# Altium schematic sheet VoltageSense.SchDoc
size A; SheetNumber: 5; SheetTotal: 5
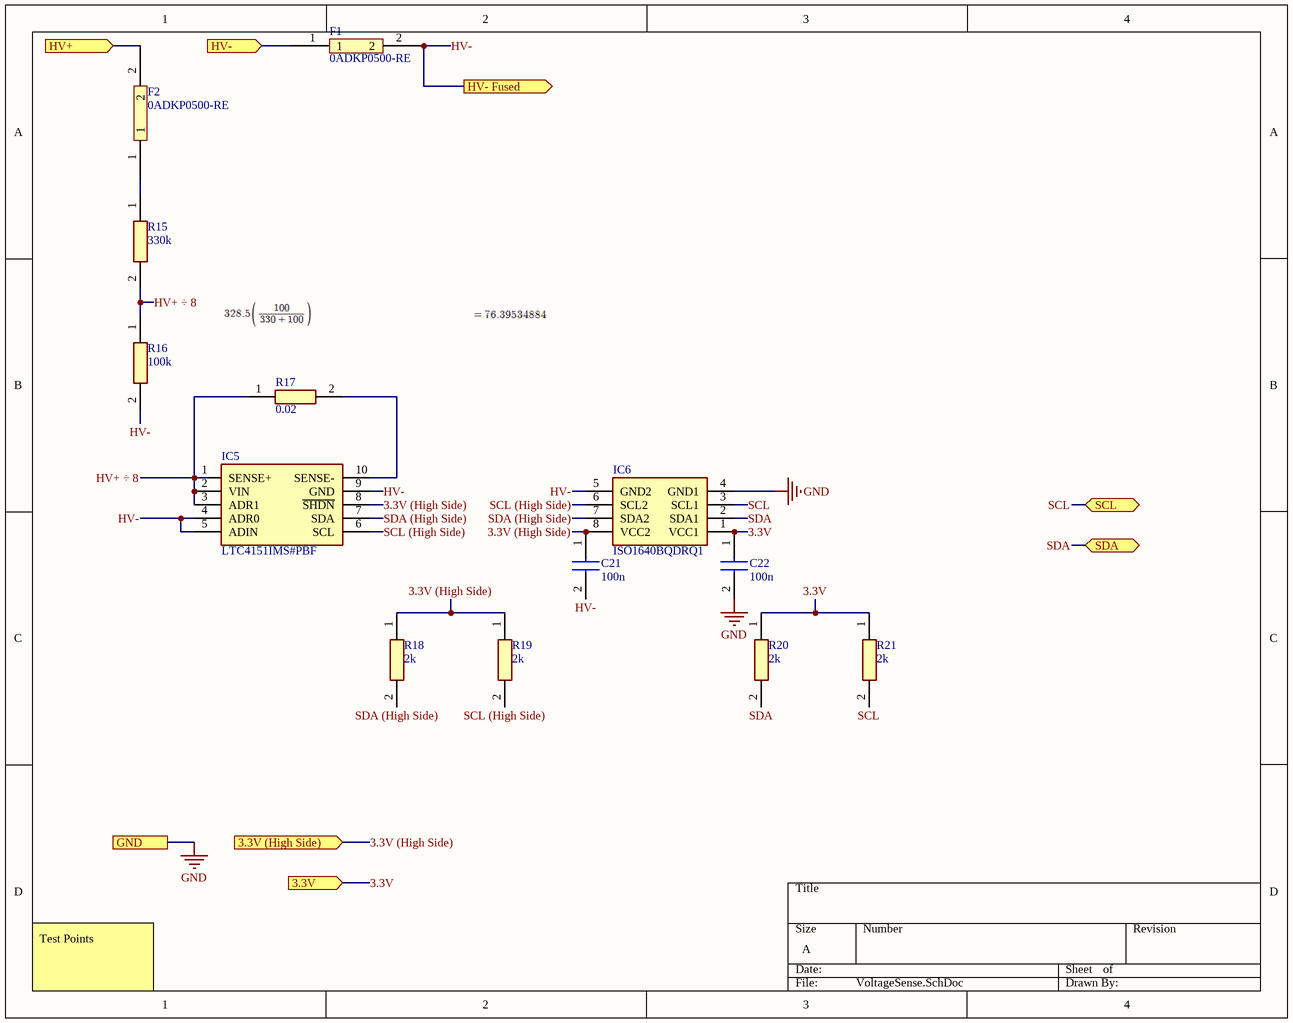
[diagram p0: VoltageSense.SchDoc]

## Parts
C21  100n  [CAPC3216X94N]
C22  100n  [CAPC3216X94N]
F1  0ADKP0500-RE  [0ADKP0500-RE]
F2  0ADKP0500-RE  [0ADKP0500-RE]
IC5  LTC4151IMS#PBF  [SOP50P490X110-10N]
IC6  ISO1640BQDRQ1  [SOIC127P600X175-8N]
R15  330k  [ERJP08_(1206)]
R16  100k  [RESC3216X65N]
R17  0.02  [RESC3216X68N]
R18  2k  [RESC3116X65N]
R19  2k  [RESC3116X65N]
R20  2k  [RESC3116X65N]
R21  2k  [RESC3116X65N]

## Ports
3.3V (High Side) (in), 3.3V (in), GND, HV+ (in), HV- (in), HV- Fused (out), SCL (bidir), SDA (bidir)

## Nets
GND: C22.2 IC6.4(GND1) ; port GND
3.3V: C22.1 IC6.1(VCC1) R20.1 R21.1 ; port 3.3V
3.3V (High Side): C21.1 IC5.8(~{SHDN}) IC6.8(VCC2) R18.1 R19.1 ; port 3.3V (High Side)
HV+: F2.2 ; port HV+
HV+ ÷ 8: IC5.1(SENSE+) IC5.2(VIN) IC5.3(ADR1) R15.2 R16.1 R17.1
HV-: C21.2 F1.2 IC5.4(ADR0) IC5.5(ADIN) IC5.9(GND) IC6.5(GND2) R16.2 ; port HV- Fused
HV-: F1.1 ; port HV-  [a separate net that carries the same name]
SCL: IC6.3(SCL1) R21.2 ; port SCL
SCL (High Side): IC5.6(SCL) IC6.6(SCL2) R19.2
SDA: IC6.2(SDA1) R20.2 ; port SDA
SDA (High Side): IC5.7(SDA) IC6.7(SDA2) R18.2
NetF2_1: F2.1 R15.1
NetIC5_10: IC5.10(SENSE-) R17.2

## Notes on the sheet
- Test Points

## Library data of the parts
C21 C22 = 12065C104J4Z2A: Capacitor; Manufacturer_Name: Kyocera AVX; Datasheet Link: https://spicat.kyocera-avx.com/product/mlcc/chartview/12065C104J4Z2A/DataSheet/X7R; Height: 0.94mm; Manufacturer_Part_Number: 12065C104J4Z2A; Mouser Part Number: 581-12065C104J4Z2A; Mouser Price/Stock: https://www.mouser.com/Search/Refine.aspx?Keyword=581-12065C104J4Z2A
F1 F2 = 0ADKP0500-RE: Fuse
IC5 = LTC4151IMS#PBF: Integrated Circuit; Manufacturer_Name: Analog Devices; Datasheet Link: http://www.linear.com/docs/26089; Height: 1.1mm; Manufacturer_Part_Number: LTC4151IMS#PBF; Mouser Part Number: 584-LTC4151IMS#PBF; Mouser Price/Stock: https://www.mouser.co.uk/ProductDetail/Analog-Devices/LTC4151IMSPBF?qs=hVkxg5c3xu%2F2n6Fpk%2FlWrA%3D%3D; Arrow Part Number: LTC4151IMS#PBF; Arrow Price/Stock: https://www.arrow.com/en/products/ltc4151imspbf/analog-devices?region=europe
IC6 = ISO1640BQDRQ1: Integrated Circuit; Manufacturer_Name: Texas Instruments; Datasheet Link: https://www.ti.com/lit/ds/symlink/iso1640.pdf; Height: 1.75mm; Manufacturer_Part_Number: ISO1640BQDRQ1; Mouser Part Number: 595-ISO1640BQDRQ1; Mouser Price/Stock: https://www.mouser.co.uk/ProductDetail/Texas-Instruments/ISO1640BQDRQ1?qs=QNEnbhJQKvat3Z1mRPODGw%3D%3D; Arrow Part Number: ISO1640BQDRQ1; Arrow Price/Stock: https://www.arrow.com/en/products/iso1640bqdrq1/texas-instruments?region=nac
R15 = ERJ-P08D3303V: Resistor; Manufacturer_Name: Panasonic; Datasheet Link: http://industrial.panasonic.com/cdbs/www-data/pdf/RDO0000/AOA0000C331.pdf; Height: 0.7mm; Manufacturer_Part_Number: ERJ-P08D3303V
R16 = MCA12060C1003FP500: Resistor; Manufacturer_Name: Vishay; Datasheet Link: https://componentsearchengine.com/Datasheets/1/MCA12060C1003FP500.pdf; Height: 0.65mm; Manufacturer_Part_Number: MCA12060C1003FP500; Mouser Part Number: 594-MCA12060C1003FP5; Mouser Price/Stock: https://www.mouser.com/Search/Refine.aspx?Keyword=594-MCA12060C1003FP5
R17 = PCS1206DR0200ET: Resistor; Manufacturer_Name: Ohmite; Datasheet Link: https://componentsearchengine.com/Datasheets/1/PCS1206DR0200ET.pdf; Height: 0.684mm; Manufacturer_Part_Number: PCS1206DR0200ET; Mouser Part Number: 588-PCS1206DR0200ET; Mouser Price/Stock: https://www.mouser.co.uk/ProductDetail/Ohmite/PCS1206DR0200ET?qs=Zz7%252BYVVL6bHe1REzh6xp%2Fw%3D%3D
R18-R21 = CHP1206AFX-2001ELF: Resistor; Manufacturer_Name: Bourns; Datasheet Link: https://www.mouser.mx/datasheet/2/54/chp-a-1858677.pdf; Height: 0.65mm; Manufacturer_Part_Number: CHP1206AFX-2001ELF; Mouser Part Number: 652-CHP1206AFX-2001L; Mouser Price/Stock: https://www.mouser.co.uk/ProductDetail/Bourns/CHP1206AFX-2001ELF?qs=GedFDFLaBXERFI3Dnxqg6Q%3D%3D